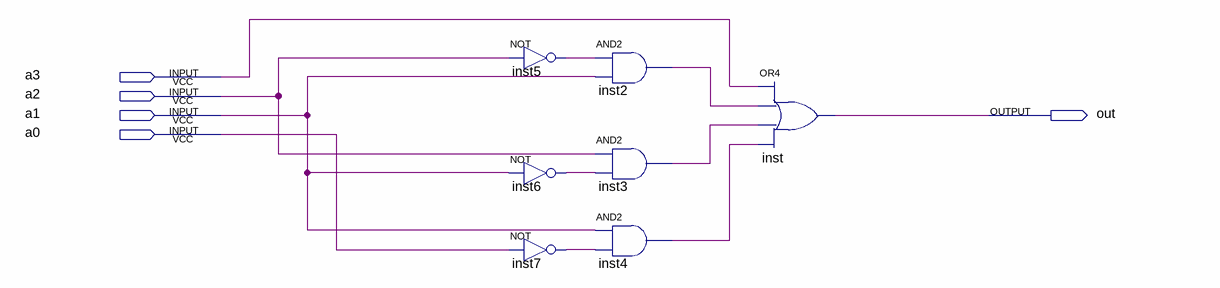
[diagram p0: schematic sheet]
// Quartus schematic FuncG.bdf as structural Verilog: 7 symbols, 5 pins
module FuncG (
  input  a3,
  input  a2,
  input  a1,
  input  a0,
  output out
);

  wire inst2_out, inst3_out, inst4_out, inst5_out, inst6_out, inst7_out;

  not inst5 (inst5_out, a2);
  not inst6 (inst6_out, a1);
  not inst7 (inst7_out, a0);
  and inst2 (inst2_out, inst5_out, a1);
  and inst3 (inst3_out, a2, inst6_out);
  and inst4 (inst4_out, a1, inst7_out);
  or inst (out, a3, inst2_out, inst3_out, inst4_out);
endmodule
